# EAGLE schematic Wristwatch_Schematic v4 (EAGLE 9.7.0)
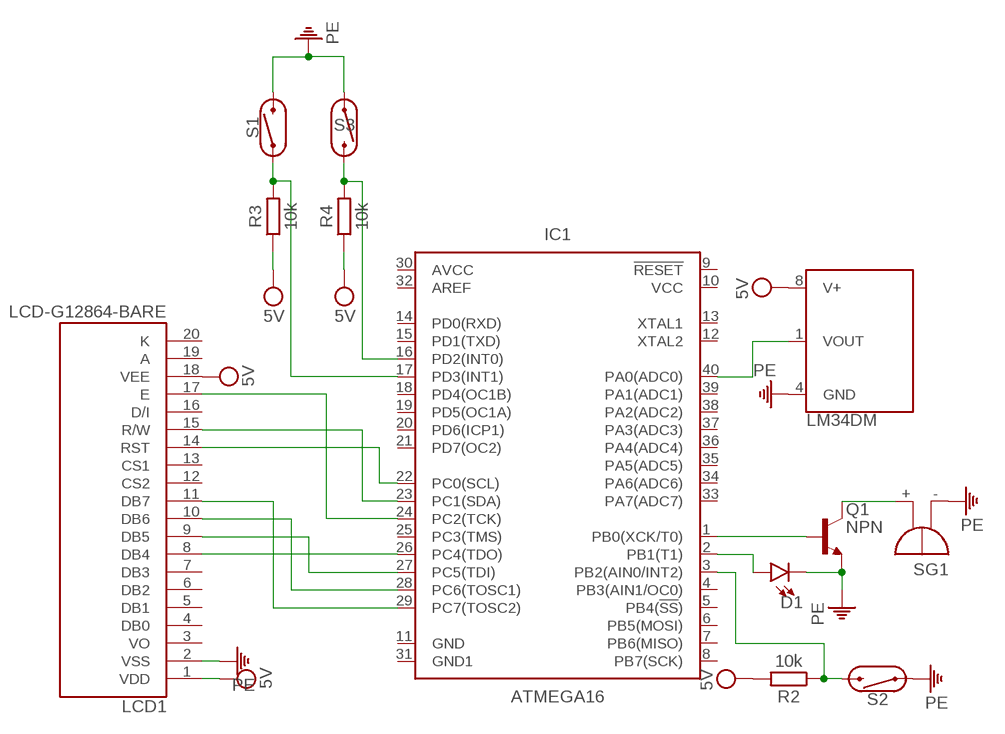
[diagram p0: schematic, sheet 1]

## Parts
D1  Yellow  LED-YELLOW-0603-WE  [LED-0603]
IC1  ATMEGA16  ATMEGA32-16PU_DIP  [DIP1587W56P254L5229H482Q40B]
LCD1  LCD-G12864-BARE  [1X20]
Q1  NPN  NPN_TO18-EBC  [TO18]
R2  10k  R_AXIAL-7.2MM-PITCH  [RESAD724W46L381D178B]
R3  10k  R_AXIAL-7.2MM-PITCH  [RESAD724W46L381D178B]
R4  10k  R_AXIAL-7.2MM-PITCH  [RESAD724W46L381D178B]
S1  REED_SWITCH-PTH-INSULATED  [REED_SWITCH_PLASTIC]
S2  REED_SWITCH-PTH-INSULATED  [REED_SWITCH_PLASTIC]
S3  REED_SWITCH-PTH-INSULATED  [REED_SWITCH_PLASTIC]
SG1  F/QMBIII  [F/QMBIII]
U1  LM34DM  [SOIC-8]

## Nets
5V: LCD1.1(VDD) LCD1.18(VEE) R2.2 R3.1 R4.1 U1.8(V+)
N$1: IC1.26(PC4(TDO)) LCD1.8(DB4)
N$2: IC1.24(PC2(TCK)) LCD1.17(E)
N$3: IC1.27(PC5(TDI)) LCD1.9(DB5)
N$4: IC1.28(PC6(TOSC1)) LCD1.10(DB6)
N$5: IC1.29(PC7(TOSC2)) LCD1.11(DB7)
N$7: IC1.23(PC1(SDA)) LCD1.15(R/W)
N$8: IC1.22(PC0(SCL)) LCD1.14(RST)
N$9: IC1.40(PA0(ADC0)) U1.1(VOUT)
N$13: IC1.1(PB0(XCK/T0)) Q1.2(B)
N$16: Q1.3(C) SG1.+(-)
N$17: D1.A IC1.2(PB1(T1))
N$22: IC1.3(PB2(AIN0/INT2)) R2.1 S2.P$2
N$24: IC1.16(PD2(INT0)) R4.2 S3.P$2
N$25: IC1.17(PD3(INT1)) R3.2 S1.P$1
PE: D1.C LCD1.2(VSS) Q1.1(E) S1.P$2 S2.P$1 S3.P$1 SG1.-(+) U1.4(GND)
Unconnected: IC1.4(PB3(AIN1/OC0)) IC1.5(PB4(!SS!)) IC1.6(PB5(MOSI)) IC1.7(PB6(MISO)) IC1.8(PB7(SCK)) IC1.9(!RESET!) IC1.12(XTAL2) IC1.13(XTAL1) IC1.14(PD0(RXD)) IC1.15(PD1(TXD)) IC1.18(PD4(OC1B)) IC1.19(PD5(OC1A)) IC1.20(PD6(ICP1)) IC1.21(PD7(OC2)) IC1.25(PC3(TMS)) IC1.32(AREF) IC1.33(PA7(ADC7)) IC1.34(PA6(ADC6)) IC1.35(PA5(ADC5)) IC1.36(PA4(ADC4)) IC1.37(PA3(ADC3)) IC1.38(PA2(ADC2)) IC1.39(PA1(ADC1)) LCD1.3(VO) LCD1.4(DB0) LCD1.5(DB1) LCD1.6(DB2) LCD1.7(DB3) LCD1.12(CS2) LCD1.13(CS1) LCD1.16(D/I)

## Power pins joined to a net without a drawn wire
A: LCD1.19(A)
AVCC: IC1.30(AVCC)
GND: IC1.11(GND)
GND1: IC1.31(GND1)
K: LCD1.20(K)
VCC: IC1.10(VCC)

## Library data of the parts
D1 = SparkFun-LED:LED-YELLOW: Yellow SMD LED Used in manufacturing several products at SparkFun. Packages: 0603 - SMD 0603 package[Product Link] <http://www.kingbrightusa.com/product.asp?catalog_name=LED&product_id=APT1608SYCK> 0603 -SMART - SMART SMD 0603 package (more efficient/more expensive) [Product Link] <http://www.osram-os.com/osram_os/en/products/product-catalog/led-light-emitting-diodes/smartled-0603/ly-l29k/index.jsp> LilyPad - SMD1206 package[Product Datasheet] <https://www.sparkfun.com/datasheets/DevTools/LilyPad/Q150YUS4.pdf> SparkFun Products: Blynk Board <https://www.sparkfun.com/products/13794> IOIO-OTG <https://www.sparkfun.com/products/13613> XBee Explorer Serial <https://www.sparkfun.com/products/13225>; PROD_ID: DIO-16514
IC1 = IC_Embedded:ATMEGA32*DIP: 8-bit Microcontroller with 32KBytes In-System Programmable Flash Datasheet <http://ww1.microchip.com/downloads/en/DeviceDoc/doc2503.pdf>; CATEGORY: IC_Embedded; DESCRIPTION: IC MCU 8BIT 32KB FLASH 40DIP; MANUFACTURER: Microchip Technology; MPN: ATMEGA32-16PU; OPERATING_TEMP: -40°C to 85°C; PART_STATUS: Active; SERIES: AVR® ATmega; SPEED: 16MHz; SUB-CATEGORY: Microcontroller
LCD1 = SparkFun-Displays:LCD-G12864: Graphical LCD 128x64 Graphical LCD 644x128 with LED Backlight. STN Type. KS0108B parallel interface chipset. Datasheet <https://www.sparkfun.com/datasheets/LCD/GDM12864H.pdf> SparkFun Products: Graphic LCD 128x64 <https://www.sparkfun.com/products/710>; SF_ID: LCD-00710
Q1 = Transistor:NPN: NPN - Generic; CATEGORY: Transistor; SUB-CATEGORY: BJT; TYPE: NPN
R2-R4 = Resistor:R: Resistor Fixed - Generic; CATEGORY: Resistor; SUB-CATEGORY: Fixed
S1-S3 = SparkFun-Switches:REED_SWITCH: Reed Switch A reed switch is a magnetically-actuated switch. When the device is exposed to a magnetic field, the two ferrous materials inside the switch pull together and the switch closes. Variant Overview PTH-GLASS Reed Switch <https://www.sparkfun.com/products/8642> (COM-08642) - PTH reed switch w/ glass body (6.0 x 0.9 mm) PTH-INSULATED Reed Switch - Insulated <https://www.sparkfun.com/products/10601> (COM-10601) - PTH reed switch w/ insulated body (15.1 x 4.2 mm); PROD_ID: SWCH-10467; SF_SKU: COM-10601
SG1 = buzzer:F/QMBIII: BUZZER Source: Buerklin; OC_FARNELL: unknown; OC_NEWARK: unknown
U1 = SparkFun-Sensors:LM34: Texas Instruments LM34 - Precision Fahrenheit Temperature Sensor 10mV/degF, 1 degF accurate analog temp sensor Datasheet <http://www.ti.com/lit/ds/symlink/lm34.pdf>; PROD_ID: IC-08232